# Altium schematic sheet sch_pwr.SchDoc
size A
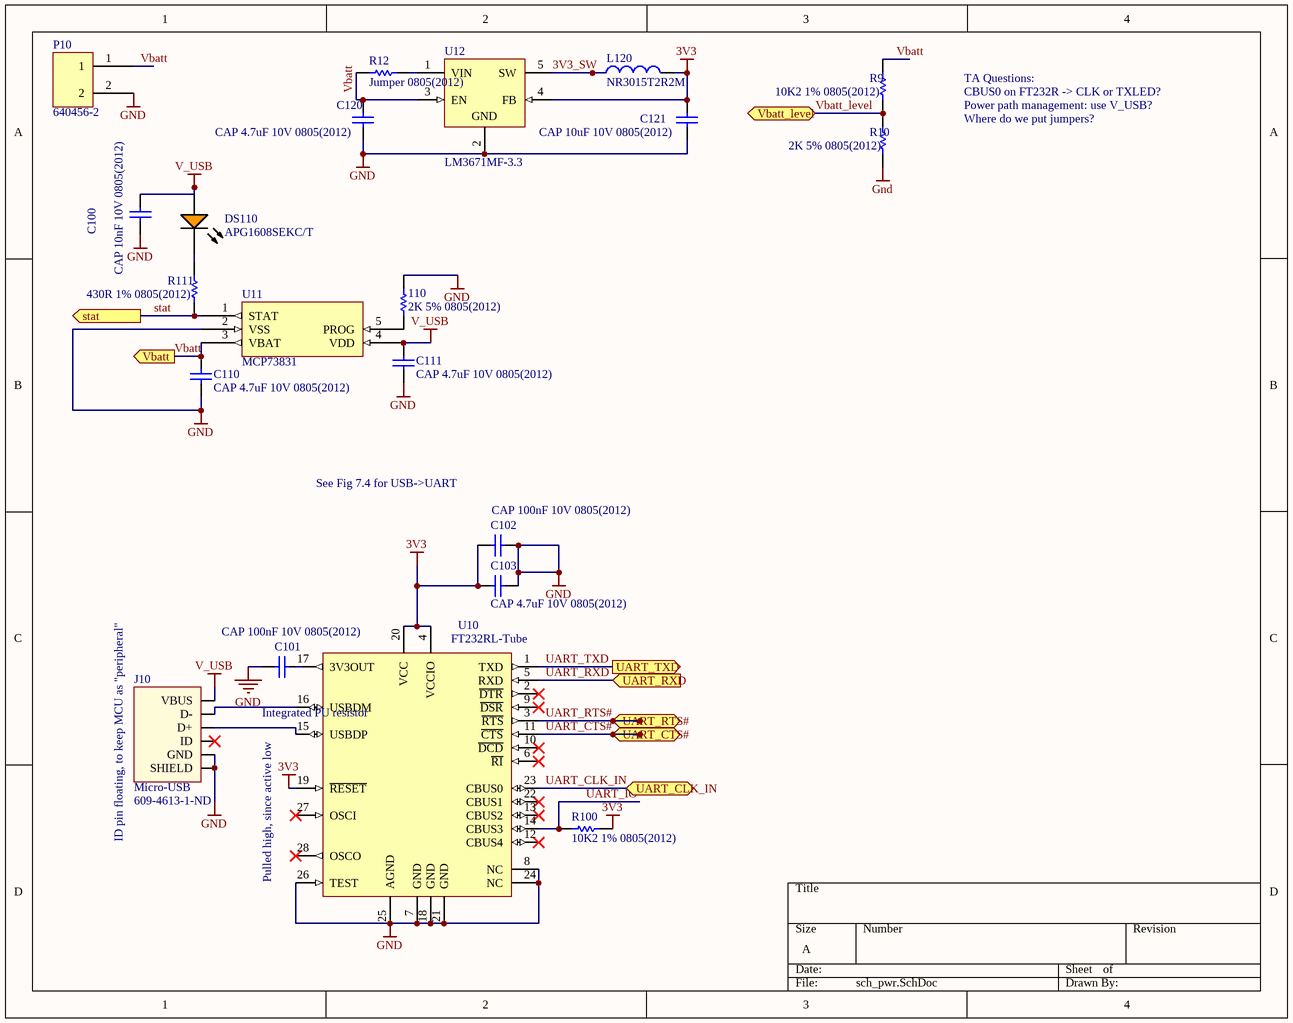
[diagram p0: sch_pwr.SchDoc]

## Parts
110  2K 5% 0805(2012)  [RESC0805(2012)_N]
C100  CAP 10nF 10V 0805(2012)  [CAPC0805(2012)75_L]
C101  CAP 100nF 10V 0805(2012)  [CAPC0805(2012)100_N]
C102  CAP 100nF 10V 0805(2012)  [CAPC0805(2012)100_N]
C103  CAP 4.7uF 10V 0805(2012)  [CAPC0805(2012)155_L]
C110  CAP 4.7uF 10V 0805(2012)  [CAPC0805(2012)155_L]
C111  CAP 4.7uF 10V 0805(2012)  [CAPC0805(2012)155_L]
C120  CAP 4.7uF 10V 0805(2012)  [CAPC0805(2012)155_L]
C121  CAP 10uF 10V 0805(2012)  [CAPC0805(2012)145_N]
DS110  APG1608SEKC/T  [KING-LED0603-25-ORANGE_V]
J10  Micro-USB  Supplier Part Number 1: 609-4613-1-ND  [10118192-0001LF]
L120  NR3015T2R2M  [TAYO-IND0315_V]
P10  640456-2  [640456-2]
R9  10K2 1% 0805(2012)  [RESC0805(2012)_L]
R10  2K 5% 0805(2012)  [RESC0805(2012)_N]
R12  Jumper 0805(2012)  [RESC0805(2012)_N]
R100  10K2 1% 0805(2012)  [RESC0805(2012)_L]
R111  430R 1% 0805(2012)  [RESC0805(2012)_L]
U10  FT232RL-Tube  [SSOP-28_N]
U11  MCP73831  [MCP73831-SOT23]
U12  LM3671MF-3.3  [MF05A_N]

## Ports
stat (out), UART_CLK_IN (bidir), UART_CTS# (in), UART_RTS# (out), UART_RXD (in), UART_TXD (out), Vbatt (out), Vbatt_level

## Nets
3V3: C102.2 C103.2 C121.1 L120.2 R100.2 U10.4(VCCIO) U10.19(~{RESET}) U10.20(VCC) U12.4(FB)
GND: 110.2 C100.1 C101.1 C102.1 C103.1 C110.2 C111.1 C120.1 C121.2 J10.5(GND) J10.6(SHIELD) P10.2 R10.1 U10.7(GND) U10.8(NC) U10.18(GND) U10.21(GND) U10.24(NC) U10.25(AGND) U10.26(TEST) U11.2(VSS) U12.2(GND)
V_USB: C100.2 C111.2 DS110.1(A) J10.1(VBUS) U11.4(VDD)
3V3_SW: L120.1 U12.5(SW)
stat: R111.1 U11.1(STAT) ; port stat
UART_CLK_IN: U10.23(CBUS0) ; port UART_CLK_IN
UART_CTS#: U10.11(~{CTS}) ; port UART_CTS#
UART_IO: R100.1 U10.14(CBUS3)
UART_RTS#: U10.3(~{RTS}) ; port UART_RTS#
UART_RXD: U10.5(RXD) ; port UART_RXD
UART_TXD: U10.1(TXD) ; port UART_TXD
Vbatt: C110.1 C120.2 P10.1 R9.2 R12.1 U11.3(VBAT) U12.3(EN) ; port Vbatt
Vbatt_level: R9.1 R10.2 ; port Vbatt_level
Net110_1: 110.1 U11.5(PROG)
NetC101_2: C101.2 U10.17(3V3OUT)
NetDS110_2: DS110.2(K) R111.2
NetJ10_2: J10.2(D-) U10.16(USBDM)
NetJ10_3: J10.3(D+) U10.15(USBDP)
NetR12_2: R12.2 U12.1(VIN)

Not connected (* = marked no-connect by the designer): J10 4(ID)*; U10 2(~{DTR})* 6(~{RI})* 9(~{DSR})* 10(~{DCD})* 12(CBUS4)* 13(CBUS2)* 22(CBUS1)* 27(OSCI)* 28(OSCO)*

## Notes on the sheet
- CBUS0 on FT232R -> CLK or TXLED?
- TA Questions:
- Power path management: use V_USB?
- Where do we put jumpers?
- See Fig 7.4 for USB->UART
- (near U10) Integrated PU resistor
- ID pin floating, to keep MCU as "peripheral"
- Pulled high, since active low

## Library data of the parts
110 R10 = CMP-1013-00081-1: 2K 0.125W 5% 0805 (2012 Metric)  SMD; Case-EIA: 0805; Value: 2000.00 Ohm; Case-Metric: 2012; Technology: SMT; Tolerance: 5 %; Power: 0.125 W
C100 = CMP-1036-03812-1: CAP 10nF 10V -20% to +80% 0805 (2012 Metric) Thickness 0.75mm SMD; Case-EIA: 0805; Case-Metric: 2012; Technology: SMT; Max Thickness: 0.75 mm; Value: 10nF; Rated Voltage: 10 V; Tolerance: -20% to +80%
C101 C102 = CMP-1036-04396-1: CAP 100nF 10V ±20% 0805 (2012 Metric) Thickness 1mm SMD; Tolerance: Â±20%; Case-Metric: 2012; Case-EIA: 0805; Rated Voltage: 10 V; Value: 100nF; Technology: SMT; Max Thickness: 1 mm
C103 C110 C111 C120 = CMP-1036-04882-1: CAP 4.7uF 10V ±10% 0805 (2012 Metric) Thickness 1.55mm SMD; Case-EIA: 0805; Tolerance: Â±10%; Case-Metric: 2012; Rated Voltage: 10 V; Max Thickness: 1.55 mm; Technology: SMT; Value: 4.7uF
C121 = CMP-1036-04922-1: CAP 10uF 10V ±10% 0805 (2012 Metric) Thickness 1.45mm SMD; Tolerance: Â±10%; Case-EIA: 0805; Case-Metric: 2012; Value: 10uF; Technology: SMT; Rated Voltage: 10 V; Max Thickness: 1.45 mm
DS110 = CMP-0239-00002-1: LED, SMT, 0603(1608), 0.25mm Tthickness, Super Bright Orange; Forward Current: 30 mA; Power Dissipation: 75 mW; Reverse Voltage: 5 V; Packing: Reel; PackageDescription: 2-Pin SMT LED, 1.6 x 0.8 mm Body, 0.25mm Thickness; ComponentLink1URL: http://www.kingbrightusa.com/; PackageVersion: Rev. 4A, 12/2011; Storage Temperature: -40 to 85 degC; PartNumber: APG1608SEKC/T; Mounting Technology: Surface Mount; ComponentLink2Description: Datasheet; DatasheetVersion: Rev. 4A, 12/2011; ComponentLink2URL: http://www.kingbrightusa.com/images/catalog/SPEC/APG1608SEKC-T.pdf; PackageReference: LED0603-25-ORANGE; ComponentLink1Description: Manufacturer URL
J10 = 10118192-0001LF: CONN USB MICRO B RECPT SMT R/A; HelpURL: http://portal.fciconnect.com/Comergent//fci/drawing/10118192.pdf; Supplier 1: Digi-Key
L120 = CMP-0569-00001-2: SMD Power Inductor, 2.2 uH, +/- 20%, 3 x 3 x 1.5 mm, -25 to 120 degC, Pb-Free, Tape and Reel; Manufacturer: Taiyo Yuden; Inductance: 2.2 uH (+/-20%); Rated Current-Temperature Rise Current: 1500 mA; DC Resistance (max): 0.072 Ohm; Rated Current-Saturation Current: 1480 mA; Inductance Measuring Frequency: 100 kHz; Self-Resonant Frequency (min): 64 MHz; Avg. of DC. Resistance: 0.06 Ohm; Soldering Method: Reflow; Temperature Range: -25 to 120 degC; ComponentLink1Description: Manufacturer URL; Mounting Technology: Surface Mount; Halogen Free: TRUE; ComponentLink1URL: www.yuden.co.jp; Packing: Tape and Reel; DatasheetVersion: 1/11/2013; PackageDescription: 2-Pin SMT Inductor, Body 3 x 3 mm; ComponentLink2URL: http://www.yuden.co.jp/ut/product/category/inductor/NR3015T2R2M.pdf; PartNumber: NR3015T2R2M; RoHS Compliance: TRUE; PackageReference: IND3015; ComponentLink2Description: Datasheet; Case Size: 3015
P10 = 640456-2: CONN HEADER VERT 2POS .100 TIN; Manufacturer: TE Connectivity; Underplate Material: Nickel; Connector Type: Plug,Pin,Header; Contact Resistance: 6mR; Max Current Rating: 5A; Max Voltage Rating (AC): 250V; Number of Positions: 2; Backwall/Post Interruptions: No (Without); Connector System: Wire-to-Board; Plating Thickness: 3.81um; PCB Mount Retention: Without; Gender: Male; Contact Style: Straight; PCB Mounting Orientation: Vertical; Pitch: 2.54mm; Mating Post Length: 7.49mm; PCB Thickness: 0.063inch; Tail Length: 3.56mm; Approvals: CSA; Supplier 1: Digi-Key; Manufacturer Part Number: 640456-2; Stock 1: 141304; Pricing 1: 1=0.12, 10=0.117, 100=0.0724, 500=0.0599, 1000=0.0524, 5000=0.0449, 10000=0.0437 (USD); Mount: Through Hole; Colour: White,Natural,Beige; Contact Plating: Tin; Contact Material: Copper Alloy; Housing Colour: Natural; Housing Material: Polyester; Contact Shape: Square; Min Operating Temperature: -67°C; Max Operating Temperature: 221°C; Package Quantity: 5000; Packaging: Bulk; Termination: Solder; Number of Rows: 1; Fastening Type: Friction; Contact Gender: Male; Voltage Rating (AC): 250V; Number of Contacts: 2; Orientation: Straight; Contact Retention: No (Without); Mating Alignment: No (Without); Mating Retention: No (Without); PCB Mount Alignment: No (Without); Panel Mount Retention: No (Without); Sealable: No (Without); Strain Relief: No (Without); Current Rating: 5A; Number of Poles: 2; Voltage Rating: 250V; Working Voltage: 250V; Length: 5.08mm; Height: 7.87mm; Depth: 5.72mm; Lead Pitch: 2.54mm; Contact Mating Length: 0.295inch; Termination Post Length: 3.56mm; Radiation Hardening: No; ELV: Compliant; Lead Free: Lead Free; Flammability Rating: UL94 V-0; REACH SVHC: No SVHC; ComponentLink1URL: https://datasheet.ciiva.com/709/eng-cd-640456-w1-709680.pdf; ComponentLink1Description: https://datasheet.ciiva.com/709/eng-cd-640456-w1-709680.pdf; ComponentLink2URL: https://datasheet.ciiva.com/3118/eng-ds-82056-mta-0608-3118497.pdf; ComponentLink2Description: https://datasheet.ciiva.com/3118/eng-ds-82056-mta-0608-3118497.pdf; ComponentLink3URL: https://datasheet.ciiva.com/19462/613931-19462481.pdf; ComponentLink3Description: https://datasheet.ciiva.com/19462/613931-19462481.pdf; ComponentLink4URL: https://datasheet.ciiva.com/14156/04384301-14156820.pdf; ComponentLink4Description: https://datasheet.ciiva.com/14156/04384301-14156820.pdf; ComponentLink5URL: https://datasheet.ciiva.com/7128/1866390-7128742.pdf; ComponentLink5Description: https://datasheet.ciiva.com/7128/1866390-7128742.pdf; ComponentLink6URL: https://datasheet.ciiva.com/16401/eng-ds-82056-mta-0608-16401289.pdf; ComponentLink6Description: https://datasheet.ciiva.com/16401/eng-ds-82056-mta-0608-16401289.pdf; ComponentLink7URL: https://datasheet.ciiva.com/16505/eng-ds-82056-mta-0608-16505419.pdf; ComponentLink7Description: https://datasheet.ciiva.com/16505/eng-ds-82056-mta-0608-16505419.pdf; ComponentLink8URL: https://datasheet.ciiva.com/25617/0900766b80027008-25617244.pdf; ComponentLink8Description: https://datasheet.ciiva.com/25617/0900766b80027008-25617244.pdf; ComponentLink9URL: https://datasheet.ciiva.com/11746/0900766b80eb7fdd-11746365.pdf; ComponentLink9Description: https://datasheet.ciiva.com/11746/0900766b80eb7fdd-11746365.pdf; Supplier Part Number 1: A1921-ND
R9 R100 = CMP-1013-00624-1: 10K2 0.125W 1% 0805 (2012 Metric)  SMD; Case-Metric: 2012; Case-EIA: 0805; Value: 10200.00 Ohm; Technology: SMT; Tolerance: 1 %; Power: 0.125 W
R12 = CMP-1013-00001-1: Jumper 0805 (2012 Metric); Case-EIA: 0805; Value: 0.00 Ohm; Tolerance: None; Case-Metric: 2012; Technology: SMT; Power: None
R111 = CMP-1013-00468-1: 430R 0.125W 1% 0805 (2012 Metric)  SMD; Value: 430.00 Ohm; Case-Metric: 2012; Case-EIA: 0805; Power: 0.125 W; Tolerance: 1 %; Technology: SMT
U10 = CMP-0078-00028-3: USB UART Asynchronous Serial Data Transfer Chip, 28-pin SSOP, Tube; Manufacturer: FTDI; ComponentLink1Description: Manufacturer URL; ComponentLink2URL: http://www.ftdichip.com/Support/Documents/DataSheets/ICs/DS_FT232R.pdf; PackageVersion: Mar-12; PartNumber: FT232RL-Tube; RevisionNote: DatasheetVersion updated to 2.10 Mar-2012; PackageDescription: 28-Pin Small Outline Package 0.65 mm Pitch; PackageReference: SSOP-28; DatasheetVersion: ver 2.10, Mar-2012; ComponentLink2Description: Datasheet; ComponentLink1URL: http://www.ftdichip.com/
U12 = CMP-0063-01133-2: 2MHz, 600mA Step-Down DC-DC Converter, 5-pin SOT-23; Manufacturer: National Semiconductor; PackageTopMarking: SJEB*XTT; PowerWise: Y; CompType: MiscPower; ComponentLink2URL: http://www.national.com/pf/LM/LM3671.html; ComponentLink1Description: LM3671 Datasheet; ComponentLink2Description: LM3671 Web Page; PinCount: 5; PackageVersion: revD, Aug-2008; RevisionNote: Component URLs added; DatasheetVersion: Oct-2008; ComponentLink3Description: MF05A Package Page; RoHS: N; ComponentLink3URL: http://www.national.com/packaging/folders/mf05a.html; PackageReference: MF05A; ComponentLink1URL: http://www.national.com/ds/LM/LM3671.pdf; PackageDescription: Molded SOT-23, .115 x .063 x .040 in Body, 5 Lead, .0375 in Pitch